# Altium project ZVS.PrjPcb
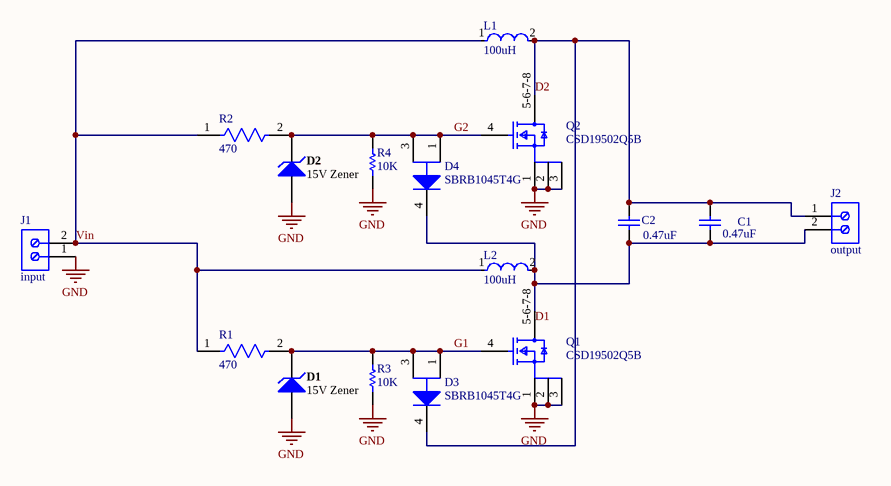
[diagram p0: zvs_circuit.SchDoc]
1 sheet, 16 parts. Net scope: global (net labels, ports and power ports of the same name join across sheets).
Board file: PCB2.PcbDoc

## Sheet zvs_circuit.SchDoc
size A4; SheetNumber: 1; SheetTotal: 1

### Parts
C1  0.47uF  [WIMA-MKS2D034701E00]
C2  0.47uF  [WIMA-MKS2D034701E00]
D1  15V Zener  [VISH-SOD-123-2_V]
D2  15V Zener  [VISH-SOD-123-2_V]
D3  SBRB1045T4G  [ONSC-D2PAK-3-418B-04_V]
D4  SBRB1045T4G  [ONSC-D2PAK-3-418B-04_V]
J1  input  [691214110002]
J2  output  [691214110002]
L1  100uH  [FP-PA4344_104NLT-MFG]
L2  100uH  [FP-PA4344_104NLT-MFG]
Q1  CSD19502Q5B  [FP-DNK0008A-MFG]
Q2  CSD19502Q5B  [FP-DNK0008A-MFG]
R1  470  [FP-CRCW2512-e3-IPC_B]
R2  470  [FP-CRCW2512-e3-IPC_B]
R3  10K  [RESC2013X60X35NL10T20]
R4  10K  [RESC2013X60X35NL10T20]

### Nets
GND: D1.1(A) D2.1(A) J1.1 Q1.1(S) Q1.2(S) Q1.3(S) Q2.1(S) Q2.2(S) Q2.3(S) R3.1 R4.1
D2: C1.2 C2.2 D3.4(K) J2.1 L1.2 Q2.5-6-7-8(D)
G1: D1.2(K) D3.1(A) D3.3(A) Q1.4(G) R1.2 R3.2
G2: D2.2(K) D4.1(A) D4.3(A) Q2.4(G) R2.2 R4.2
Vin: J1.2 L1.1 L2.1 R1.1 R2.1
NetC1_1: C1.1 C2.1 D4.4(K) J2.2 L2.2 Q1.5-6-7-8(D)

### Notes on the sheet
- Labels drawn without touching a wire or pin: D1

### Library data of the parts
C1 C2 = CMP-2000-06717-1: Metallized Polyester (PET) Capacitor, 0.47 uF, +/- 10%, 100 V DC, 63 V AC, -55 to 100 degC, 2-Pin THD, RoHS, Bulk; Manufacturer: Wima; SVHC: NoSVHC(15-Jun-2015); Capacitor Dielectric Type: PET(Polyester); Voltage Rating: 100V; Capacitance: 0.47µF; Capacitor Terminals: RadialLeaded; Product Range: MKS2Series; Package Description: 2-Pin Through Hole Device, Body 7.2 x 4.5 mm, Pitch 5 mm; Mounting Technology: ThroughHole; Package Reference: MKS2D034701E00; Packaging: Each; Automotive Qualification Standard: -; Datasheet Version: 04/2016; Manufacturer URL: http://www.wima.com/; Operating Temperature Max: 100°C; Datasheet URL: http://www.wima.com/EN/WIMA_MKS_2.pdf; Operating Temperature Min: -55°C; Capacitance Tolerance: ±10%; Lead Spacing: 5mm; Capacitor Case Style: -
D1 D2 = CMP-0931-00033-1: Small Signal Zener Diode, 15 V +/- 5%, -55 to 155 degC, 2-Pin SOD-123, RoHS, Tape and Reel; Manufacturer: Vishay Semiconductor; PartNumber: MMSZ5245B-E3-08; Int. Construction: Single; Test Current (IZT1) (mA): 8.5; Zener Impedance (IZT1) (Max.) (Ohm): 16; Zener Voltage (NOM.) (V): 15; Power Dissipation (mW): 500; Tolerance: +/- 5%; PackageDescription: 2-Pin SMD, Body 2.7 x 1.55 mm, Height 1.35 mm; ComponentLink2Description: Datasheet; PackageVersion: Rev. 1.9; ComponentLink2URL: http://www.vishay.com/docs/85774/mmsz5225.pdf; RoHS: TRUE; Packing: Tape and Reel; Operating Temperature: -55 to 150 degC; ComponentLink1Description: Manufacturer URL; ComponentLink3Description: Package Specification; PackageReference: SOD-123-2; DatasheetVersion: Rev. 1.9; ComponentLink3URL: http://www.vishay.com/docs/85774/mmsz5225.pdf; Mounting Technology: Surface Mount; ComponentLink1URL: http://www.vishay.com/
D3 D4 = CMP-1055-00091-1: SWITCHMODE(TM) Schottky Power Rectifier, Surface Mount Power Package, 3-Pin D2PAK, Pb-Free, Tape and Reel; Manufacturer: On Semiconductor; Configuration: Single; IFSM Max (A): 150; PackageReference: D2PAK-3-418B-04; ComponentLink3Description: Package Specification; RoHS: TRUE; ComponentLink2Description: Datasheet; ComponentLink1URL: http://www.onsemi.com/; Mounting Technology: Surface Mount; PackageDescription: 3-Pin Flange Mount, Body 9.145 x 9.97 mm, Pitch 2.54 mm; ComponentLink2URL: http://www.onsemi.cn/pub_link/Collateral/MBRB1045-D.PDF; PackageVersion: Rev. K, 09/2008; Packing: Tape and Reel; PartNumber: SBRB1045T4G; ComponentLink1Description: Manufacturer URL; ComponentLink3URL: http://www.onsemi.com/pub_link/Collateral/418B-04.PDF; DatasheetVersion: Rev. 8
J1 J2 = CMP-1502-02464-1: Serie 2141 - 3.50 mm Horizontal Entry Modular with Rising Cage Clamp WR-TBL, 2 pin; Manufacturer: Wurth Elektronik; Pin Number: 2; Pitch: 3.50mm; Datasheet URL: http://katalog.we-online.de/em/datasheet/6912141100xx.pdf; Packaging: Box; Mounting Technology: THT; Package Reference: 691214110002; Manufacturer URL: http://www.we-online.de; Part Number: 691214110002; Publisher: WurthElektronik; Operating Temperature: -40to105degC
L1 L2 = CMP-16293-000004-1: FIXED IND 100UH 5.3A 118 MOHM; Manufacturer: Pulse Electronics; Manufacturer Part Number: PA4344.104NLT; Tolerance: 20%; Saturation Current: 6.5A; Shielding: true; Test Frequency: 100kHz; Series Resistance: 118mΩ; Value: 100uH; Inductance: 100uH; ComponentLink2Description: Datasheet; Temperature: -55°C to +125°C; ComponentLink2URL: https://products.pulseelex.com/files/product_files/P771.pdf; Temperature Range High: +125°C; Octopart: https://octopart.com/pa4344.104nlt-pulse-65154399; Device Class L2: Inductors; Composition: Molded; Digikey Description: FIXED IND 100UH 5.3A 118 MOHM; Lead Free: Yes; Device Class L3: Fixed Inductors; Category: Ind; Temperature Range Low: -55°C; Height: 7mm; Automotive: No; Device Class L1: Passive Components; RoHS: TRUE; Rms Current: 5.3A; Package: 0
Q1 Q2 = CMP-04962-000029-1: MOSFET N-CH 80V 100A 8SON; Element Configuration: Single; Number of Channels: 1; Fall Time: 7ns; Threshold Voltage: 2.7V; Gate to Source Voltage (Vgs): 20V; Input Capacitance: 4.87nF; Drain to Source Resistance: 3.4mR; Turn-On Delay Time: 8ns; Power Dissipation: 3.2W; Rise Time: 6ns; Turn-Off Delay Time: 22ns; Rds On Max: 4.1mR; Number of Pins: 8; Min Operating Temperature: -55°C; Continuous Drain Current (ID): 100A; Number of Elements: 1; Max Operating Temperature: 150°C; Package Quantity: 2500; Packaging: Tape and Reel; Drain to Source Breakdown Voltage: 80V; RoHS Compliant: Yes; Mount: Surface Mount; Drain to Source Voltage (Vdss): 80V; REACH SVHC: No SVHC; Lead Free: Contains Lead; Max Power Dissipation: 3.2W
R1 R2 = CMP-02407-009143-1: RES Thick Film, 470Ω, 1%, 1W, 100ppm/°C, 2512; Voltage Rating (DC): 500V; Resistance: 470R; Max Power Dissipation: 1W; Depth: 3.15mm; Termination: SMD/SMT; Package Quantity: 10; Case/Package: 2512; Lead Free: Lead Free; Composition: Thick Film; Radiation Hardening: No; Width: 0.124inch; Min Operating Temperature: -55°C; Tolerance: 1%; Temperature Coefficient: 100ppm/°C; Power Rating: 1W; Case Code (Imperial): 2512; Military Standard: Not; Max Operating Temperature: 155°C; Number of Terminations: 2; Case Code (Metric): 6432; Mount: Surface Mount; Length: 6.3mm; Height: 0.028inch; Features: Automotive AEC-Q200; Contact Plating: Tin; Packaging: Tape and Reel
R3 R4 = CMP-1659-00013-4: Chip Resistor, 10 KOhm, +/- 1%, 0.125 W, -55 to 155 degC, 0805 (2012 Metric), RoHS, Tape and Reel; Manufacturer: Yageo; Voltage Rating: 150 V; Mount: Surface Mount; ComponentLink1Description: Manufacturer URL; ComponentLink2URL: http://www.yageo.com/documents/recent/PYu-RC_Group_51_RoHS_L_04.pdf; Pins: 2; Length: 2 mm; Min Operating Temperature: -55 degC; Height: 0.5 mm; Mounting Technology: Surface Mount; RoHSCompliant: true; REACH SVHC: No SVHC; ComponentLink1URL: http://www.yageo.com/; Max Operating Temperature: 155 degC; PackageReference: 0805; DatasheetVersion: Rev. 4, 02/2016; Package Quantity: 5000; Packaging: Tape and Reel; ComponentLink2Description: Datasheet; PackageDescription: 2-Pin Surface Mounted Device, Body 2 x 1.25 mm